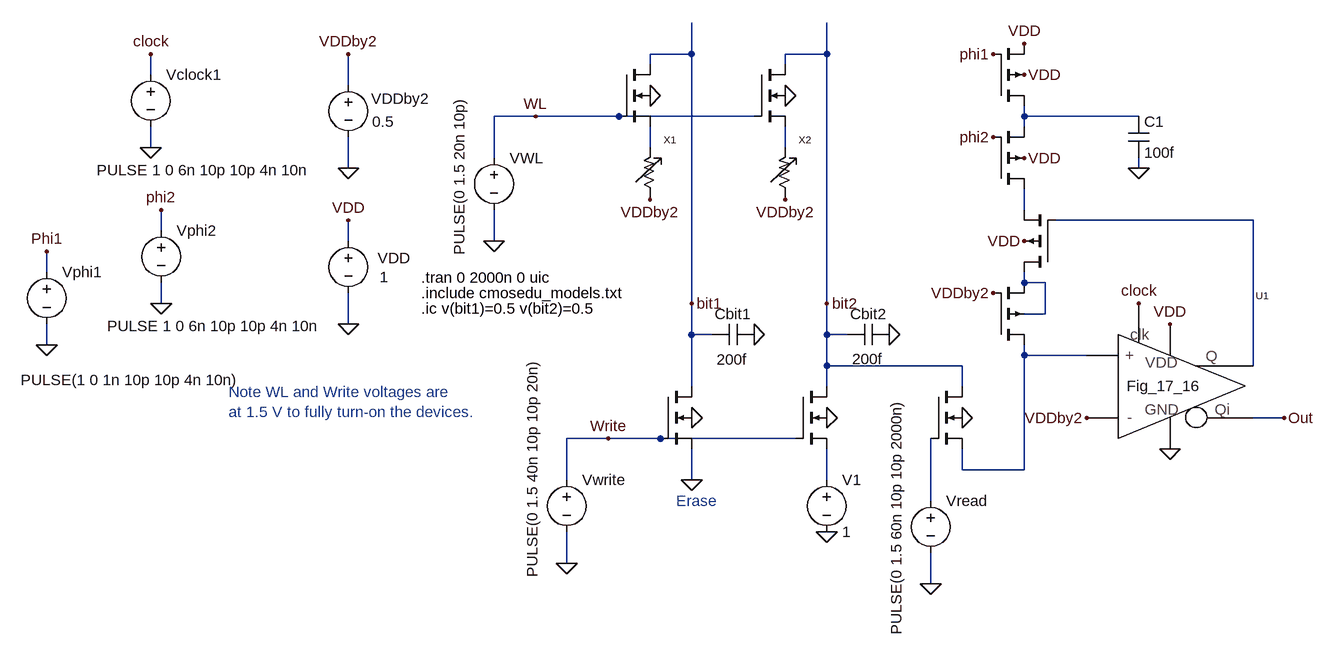
[diagram p0: schematic proj1_sim3.asc]
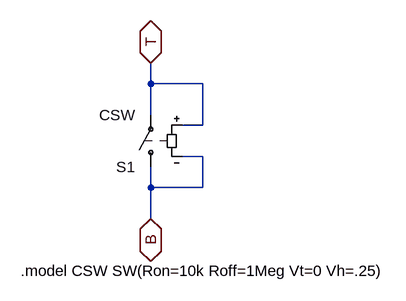
[diagram p1: sub-circuit mbit.asc]
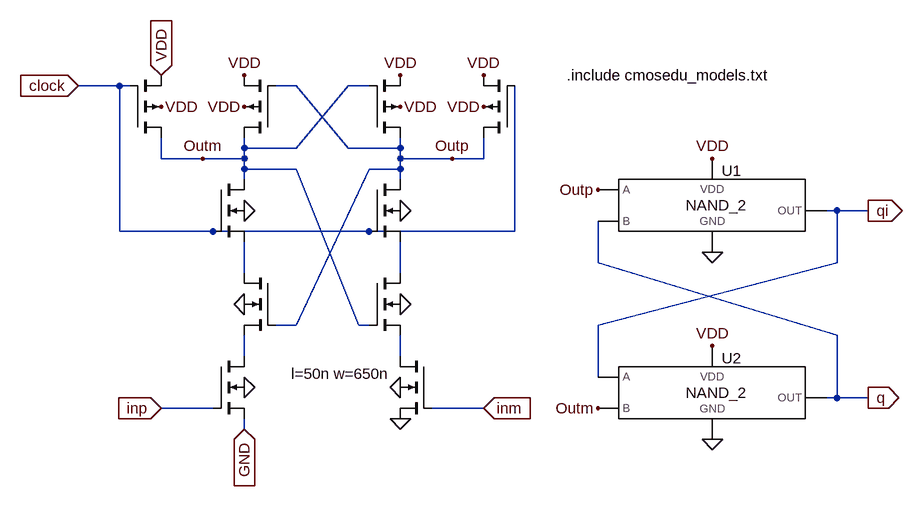
[diagram p2: sub-circuit fig_17_16.asc]
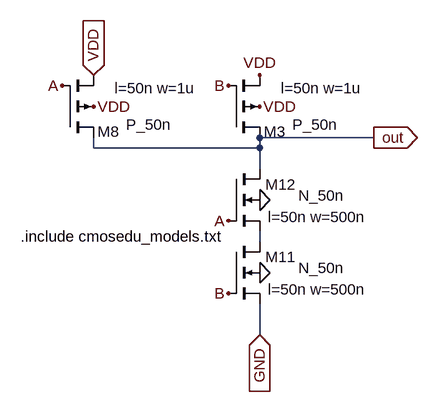
[diagram p3: sub-circuit nand_2.asc]
proj1_sim3.asc, the LTspice schematic file:
Version 4
SHEET 1 1612 1576
WIRE 368 -16 368 -64
WIRE 368 -16 304 -16
WIRE 576 -16 576 -64
WIRE 576 -16 512 -16
WIRE 304 0 304 -16
WIRE 512 0 512 -16
WIRE -464 16 -464 -16
WIRE -160 32 -160 -16
WIRE 128 80 64 80
WIRE 256 80 128 80
WIRE 464 80 256 80
WIRE 880 80 880 64
WIRE 1056 80 880 80
WIRE 880 96 880 80
WIRE -464 128 -464 96
WIRE 304 128 304 96
WIRE 512 128 512 96
WIRE 64 144 64 80
WIRE -160 160 -160 112
WIRE 1056 160 1056 144
WIRE 880 224 880 192
WIRE 1232 240 928 240
WIRE -448 256 -448 224
WIRE -160 272 -160 240
WIRE 64 272 64 224
WIRE -624 320 -624 288
WIRE 880 336 880 320
WIRE 912 336 880 336
WIRE -448 368 -448 336
WIRE 368 368 368 -16
WIRE 576 368 576 -16
WIRE 912 384 912 336
WIRE 912 384 880 384
WIRE -160 400 -160 352
WIRE 368 416 368 368
WIRE 400 416 368 416
WIRE 576 416 576 368
WIRE 608 416 576 416
WIRE -624 432 -624 400
WIRE 880 448 880 432
WIRE 976 448 880 448
WIRE 576 464 576 416
WIRE 784 464 576 464
WIRE 1232 464 1232 240
WIRE 368 496 368 416
WIRE 576 496 576 464
WIRE 784 496 784 464
WIRE 1280 544 1232 544
WIRE 240 576 176 576
WIRE 320 576 240 576
WIRE 528 576 320 576
WIRE 784 624 784 592
WIRE 880 624 880 448
WIRE 880 624 784 624
WIRE 176 640 176 576
WIRE 368 640 368 592
WIRE 576 640 576 592
WIRE 736 672 736 576
WIRE 176 768 176 720
WIRE 736 800 736 752
FLAG 304 48 0
FLAG 304 208 VDDby2
FLAG 512 48 0
FLAG 512 208 VDDby2
FLAG 64 272 0
FLAG 128 80 WL
FLAG 464 416 0
FLAG 672 416 0
FLAG 368 544 0
FLAG 576 544 0
FLAG 176 768 0
FLAG 240 576 Write
FLAG 368 640 0
FLAG -160 400 0
FLAG 368 368 bit1
FLAG 576 368 bit2
FLAG -160 160 0
FLAG -160 -16 VDDby2
FLAG -160 240 VDD
FLAG 576 720 0
FLAG 880 16 VDD
FLAG 880 -32 VDD
FLAG -624 432 0
FLAG -624 288 Phi1
FLAG -448 368 0
FLAG -448 224 phi2
FLAG 880 144 VDD
FLAG 880 272 VDD
FLAG 832 -16 phi1
FLAG 832 112 phi2
FLAG 1056 160 0
FLAG 832 352 VDDby2
FLAG 1104 400 VDD
FLAG -464 128 0
FLAG -464 -16 clock
FLAG 976 544 VDDby2
FLAG 1056 368 clock
FLAG 1104 592 0
FLAG 1280 544 Out
FLAG 784 544 0
FLAG 736 800 0
SYMBOL nmos4 256 0 R0
WINDOW 0 56 32 Invisible 0
WINDOW 3 56 72 Invisible 0
SYMATTR InstName M1
SYMATTR Value N_50n
SYMATTR Value2 l=50n w=250n
SYMBOL nmos4 464 0 R0
WINDOW 0 56 32 Invisible 0
WINDOW 3 56 72 Invisible 0
SYMATTR InstName M2
SYMATTR Value N_50n
SYMATTR Value2 l=50n w=250n
SYMBOL voltage 64 128 R0
WINDOW 3 -53 166 VLeft 0
WINDOW 123 0 0 Left 0
WINDOW 39 0 0 Left 0
SYMATTR Value PULSE(0 1.5 20n 10p)
SYMATTR InstName VWL
SYMBOL cap 672 400 R90
WINDOW 0 0 32 VBottom 0
WINDOW 3 38 33 VTop 0
SYMATTR InstName Cbit2
SYMATTR Value 200f
SYMBOL cap 464 400 R90
WINDOW 0 0 32 VBottom 0
WINDOW 3 39 34 VTop 0
SYMATTR InstName Cbit1
SYMATTR Value 200f
SYMBOL nmos4 320 496 R0
WINDOW 0 56 32 Invisible 0
WINDOW 3 56 72 Invisible 0
SYMATTR InstName M3
SYMATTR Value N_50n
SYMATTR Value2 l=50n w=2500n
SYMBOL nmos4 528 496 R0
WINDOW 0 56 32 Invisible 0
WINDOW 3 56 72 Invisible 0
SYMATTR InstName M4
SYMATTR Value N_50n
SYMATTR Value2 l=50n w=2500n
SYMBOL voltage 176 624 R0
WINDOW 3 -53 166 VLeft 0
WINDOW 123 0 0 Left 0
WINDOW 39 0 0 Left 0
SYMATTR Value PULSE(0 1.5 40n 10p 10p 20n)
SYMATTR InstName Vwrite
SYMBOL voltage -160 256 R0
WINDOW 0 45 42 Left 0
WINDOW 3 48 71 Left 0
SYMATTR InstName VDD
SYMATTR Value 1
SYMBOL voltage -160 16 R0
WINDOW 0 35 37 Left 0
WINDOW 3 37 72 Left 0
SYMATTR InstName VDDby2
SYMATTR Value 0.5
SYMBOL voltage 576 624 R0
WINDOW 123 0 0 Left 0
WINDOW 39 0 0 Left 0
SYMATTR InstName V1
SYMATTR Value 1
SYMBOL mbit 304 128 R0
SYMATTR InstName X1
SYMBOL mbit 512 128 R0
SYMATTR InstName X2
SYMBOL pmos4 832 64 M180
WINDOW 0 56 32 Invisible 0
WINDOW 3 56 72 Invisible 0
SYMATTR InstName M7
SYMATTR Value P_50n
SYMATTR Value2 l=50n w=1u
SYMBOL voltage -624 304 R0
WINDOW 123 0 0 Left 0
WINDOW 39 0 0 Left 0
WINDOW 3 -40 182 Left 0
SYMATTR Value PULSE(1 0 1n 10p 10p 4n 10n)
SYMATTR InstName Vphi1
SYMBOL voltage -448 240 R0
WINDOW 123 0 0 Left 0
WINDOW 39 0 0 Left 0
WINDOW 3 -83 163 Left 0
SYMATTR Value PULSE 1 0 6n 10p 10p 4n 10n
SYMATTR InstName Vphi2
SYMBOL pmos4 832 192 M180
WINDOW 0 56 32 Invisible 0
WINDOW 3 56 72 Invisible 0
SYMATTR InstName M8
SYMATTR Value P_50n
SYMATTR Value2 l=50n w=1u
SYMBOL pmos4 928 320 R180
WINDOW 0 56 32 Invisible 0
WINDOW 3 56 72 Invisible 0
SYMATTR InstName M9
SYMATTR Value P_50n
SYMATTR Value2 l=50n w=1u
SYMBOL cap 1040 80 R0
SYMATTR InstName C1
SYMATTR Value 100f
SYMBOL pmos4 832 432 M180
WINDOW 0 56 32 Invisible 0
WINDOW 3 56 72 Invisible 0
SYMATTR InstName M10
SYMATTR Value P_50n
SYMATTR Value2 l=50n w=1u
SYMBOL Fig_17_16 1024 496 R0
SYMATTR InstName U1
SYMBOL voltage -464 0 R0
WINDOW 123 0 0 Left 0
WINDOW 39 0 0 Left 0
WINDOW 3 -83 163 Left 0
SYMATTR Value PULSE 1 0 6n 10p 10p 4n 10n
SYMATTR InstName Vclock1
SYMBOL nmos4 736 496 R0
WINDOW 0 56 32 Invisible 0
WINDOW 3 56 72 Invisible 0
SYMATTR InstName M5
SYMATTR Value N_50n
SYMATTR Value2 l=50n w=250n
SYMBOL voltage 736 656 R0
WINDOW 3 -53 223 VLeft 0
WINDOW 123 0 0 Left 0
WINDOW 39 0 0 Left 0
SYMATTR Value PULSE(0 1.5 60n 10p 10p 2000n)
SYMATTR InstName Vread
TEXT -48 352 Left 0 !.include cmosedu_models.txt
TEXT -48 328 Left 0 !.tran 0 2000n 0 uic
TEXT -48 376 Left 0 !.ic v(bit1)=0.5 v(bit2)=0.5
TEXT -344 504 Left 0 ;Note WL and Write voltages are \nat 1.5 V to fully turn-on the devices.
TEXT 344 672 Left 0 ;Erase

mbit.asc, the sub-circuit schematic file:
Version 4
SHEET 1 984 680
WIRE -288 -128 -288 -160
WIRE -208 -128 -288 -128
WIRE -288 -80 -288 -128
WIRE -208 -64 -208 -128
WIRE -208 -64 -240 -64
WIRE -208 -16 -240 -16
WIRE -288 32 -288 0
WIRE -208 32 -208 -16
WIRE -208 32 -288 32
WIRE -288 80 -288 32
FLAG -288 -160 T
IOPIN -288 -160 BiDir
FLAG -288 80 B
IOPIN -288 80 BiDir
SYMBOL sw -288 16 R180
SYMATTR InstName S1
SYMATTR Value CSW
TEXT -488 160 Left 0 !.model CSW SW(Ron=10k Roff=1Meg Vt=0 Vh=.25)

fig_17_16.asc, the sub-circuit schematic file:
Version 4
SHEET 1 1760 680
WIRE 528 -560 464 -560
WIRE 544 -560 528 -560
WIRE 800 -560 768 -560
WIRE 912 -560 880 -560
WIRE 720 -464 720 -480
WIRE 800 -464 880 -560
WIRE 800 -464 720 -464
WIRE 880 -464 800 -560
WIRE 960 -464 960 -480
WIRE 960 -464 880 -464
WIRE 592 -448 592 -480
WIRE 656 -448 592 -448
WIRE 720 -448 720 -464
WIRE 720 -448 656 -448
WIRE 960 -448 960 -464
WIRE 1040 -448 960 -448
WIRE 1088 -448 1088 -480
WIRE 1088 -448 1040 -448
WIRE 720 -432 720 -448
WIRE 800 -432 720 -432
WIRE 960 -432 960 -448
WIRE 960 -432 912 -432
WIRE 720 -416 720 -432
WIRE 960 -416 960 -432
WIRE 1632 -368 1616 -368
WIRE 1680 -368 1632 -368
WIRE 528 -336 528 -560
WIRE 672 -336 528 -336
WIRE 912 -336 672 -336
WIRE 1136 -336 1136 -560
WIRE 1136 -336 912 -336
WIRE 1264 -288 1264 -352
WIRE 1632 -288 1632 -368
WIRE 720 -272 720 -320
WIRE 960 -272 960 -320
WIRE 800 -192 912 -432
WIRE 800 -192 768 -192
WIRE 896 -192 800 -432
WIRE 912 -192 896 -192
WIRE 1264 -192 1632 -288
WIRE 1632 -176 1264 -288
WIRE 720 -144 720 -176
WIRE 960 -144 960 -176
WIRE 1264 -112 1264 -192
WIRE 1632 -80 1632 -176
WIRE 1632 -80 1616 -80
WIRE 1680 -80 1632 -80
WIRE 672 -64 592 -64
WIRE 1088 -64 1008 -64
WIRE 720 -32 720 -48
FLAG 720 -96 0
FLAG 720 -528 VDD
FLAG 960 -528 VDD
FLAG 720 -576 VDD
FLAG 960 -576 VDD
FLAG 960 -224 0
FLAG 720 -224 0
FLAG 592 -528 VDD
FLAG 1088 -528 VDD
FLAG 1088 -576 VDD
FLAG 720 -368 0
FLAG 960 -368 0
FLAG 960 -96 0
FLAG 960 -48 0
FLAG 1040 -448 Outp
FLAG 656 -448 Outm
FLAG 1440 -304 0
FLAG 1440 -16 0
FLAG 1440 -448 VDD
FLAG 1440 -160 VDD
FLAG 1264 -400 Outp
FLAG 1264 -64 Outm
FLAG 592 -64 inp
IOPIN 592 -64 In
FLAG 1088 -64 inm
IOPIN 1088 -64 In
FLAG 464 -560 clock
IOPIN 464 -560 In
FLAG 1680 -368 qi
IOPIN 1680 -368 Out
FLAG 1680 -80 q
IOPIN 1680 -80 Out
FLAG 592 -576 VDD
IOPIN 592 -576 In
FLAG 720 -32 GND
IOPIN 720 -32 In
SYMBOL nmos4 672 -144 R0
WINDOW 0 104 24 Invisible 0
WINDOW 3 179 41 Invisible 0
SYMATTR InstName M1
SYMATTR Value N_50n
SYMATTR Value2 l=50n w=500n
SYMBOL pmos4 768 -480 R180
WINDOW 0 56 32 Invisible 0
WINDOW 3 56 72 Invisible 0
SYMATTR InstName M2
SYMATTR Value P_50n
SYMATTR Value2 l=50n w=1u
SYMBOL pmos4 912 -480 M180
WINDOW 0 56 32 Invisible 0
WINDOW 3 56 72 Invisible 0
SYMATTR InstName M3
SYMATTR Value P_50n
SYMATTR Value2 l=50n w=1u
SYMBOL nmos4 912 -272 R0
WINDOW 0 104 24 Invisible 0
WINDOW 3 179 41 Invisible 0
SYMATTR InstName M5
SYMATTR Value N_50n
SYMATTR Value2 l=50n w=500n
SYMBOL nmos4 768 -272 M0
WINDOW 0 104 24 Invisible 0
WINDOW 3 179 41 Invisible 0
SYMATTR InstName M6
SYMATTR Value N_50n
SYMATTR Value2 l=50n w=500n
SYMBOL pmos4 544 -480 M180
WINDOW 0 56 32 Invisible 0
WINDOW 3 56 72 Invisible 0
SYMATTR InstName M4
SYMATTR Value P_50n
SYMATTR Value2 l=50n w=1u
SYMBOL pmos4 1136 -480 R180
WINDOW 0 56 32 Invisible 0
WINDOW 3 56 72 Invisible 0
SYMATTR InstName M7
SYMATTR Value P_50n
SYMATTR Value2 l=50n w=1u
SYMBOL nmos4 672 -416 R0
WINDOW 0 104 24 Invisible 0
WINDOW 3 179 41 Invisible 0
SYMATTR InstName M8
SYMATTR Value N_50n
SYMATTR Value2 l=50n w=500n
SYMBOL nmos4 912 -416 R0
WINDOW 0 104 24 Invisible 0
WINDOW 3 179 41 Invisible 0
SYMATTR InstName M9
SYMATTR Value N_50n
SYMATTR Value2 l=50n w=500n
SYMBOL nmos4 1008 -144 M0
WINDOW 0 104 24 Invisible 0
WINDOW 3 179 41 Invisible 0
WINDOW 123 64 27 Left 0
SYMATTR InstName M10
SYMATTR Value N_50n
SYMATTR Value2 l=50n w=650n
SYMBOL NAND_2 1216 -352 R0
SYMATTR InstName U1
SYMBOL NAND_2 1216 -64 R0
SYMATTR InstName U2
TEXT 1216 -576 Left 0 !.include cmosedu_models.txt

nand_2.asc, the sub-circuit schematic file:
Version 4
SHEET 1 6288 680
WIRE 1344 -416 1168 -416
WIRE 912 -400 912 -416
WIRE 1168 -400 1168 -416
WIRE 1168 -400 912 -400
WIRE 1168 -368 1168 -400
WIRE 1168 -256 1168 -272
WIRE 1168 -112 1168 -160
FLAG 1168 -464 VDD
FLAG 912 -464 VDD
FLAG 1168 -208 0
FLAG 1168 -320 0
FLAG 1168 -512 VDD
FLAG 912 -512 VDD
IOPIN 912 -512 In
FLAG 1168 -112 GND
IOPIN 1168 -112 In
FLAG 1344 -416 out
IOPIN 1344 -416 Out
FLAG 864 -496 A
FLAG 1120 -288 A
FLAG 1120 -496 B
FLAG 1120 -176 B
SYMBOL pmos4 1120 -416 M180
WINDOW 0 88 9 Right 0
WINDOW 3 168 20 Right 0
WINDOW 123 206 76 Right 0
SYMATTR InstName M3
SYMATTR Value P_50n
SYMATTR Value2 l=50n w=1u
SYMBOL pmos4 864 -416 M180
WINDOW 0 88 9 Right 0
WINDOW 3 168 20 Right 0
WINDOW 123 206 76 Right 0
SYMATTR InstName M8
SYMATTR Value P_50n
SYMATTR Value2 l=50n w=1u
SYMBOL nmos4 1120 -256 R0
WINDOW 0 104 24 Right 0
WINDOW 3 179 41 Right 0
WINDOW 123 213 74 Right 0
SYMATTR InstName M11
SYMATTR Value N_50n
SYMATTR Value2 l=50n w=500n
SYMBOL nmos4 1120 -368 R0
WINDOW 0 104 24 Right 0
WINDOW 3 179 41 Right 0
WINDOW 123 213 74 Right 0
SYMATTR InstName M12
SYMATTR Value N_50n
SYMATTR Value2 l=50n w=500n
TEXT 800 -264 Left 0 !.include cmosedu_models.txt

The netlist it stands for:
* proj1_sim3.asc
M1 bit1 WL N002 0 N_50n l=50n w=250n
M2 bit2 WL N003 0 N_50n l=50n w=250n
VWL WL 0 PULSE(0 1.5 20n 10p)
Cbit2 0 bit2 200f
Cbit1 0 bit1 200f
M3 bit1 Write 0 0 N_50n l=50n w=2500n
M4 bit2 Write N008 0 N_50n l=50n w=2500n
Vwrite Write 0 PULSE(0 1.5 40n 10p 10p 20n)
VDD VDD 0 1
VDDby2 VDDby2 0 0.5
V1 N008 0 1
XX1 N002 VDDby2 mbit
XX2 N003 VDDby2 mbit
M7 N001 Phi1 VDD VDD P_50n l=50n w=1u
Vphi1 Phi1 0 PULSE(1 0 1n 10p 10p 4n 10n)
Vphi2 phi2 0 PULSE 1 0 6n 10p 10p 4n 10n
M8 N004 phi2 N001 VDD P_50n l=50n w=1u
M9 N006 N005 N004 VDD P_50n l=50n w=1u
C1 N001 0 100f
M10 N007 VDDby2 N006 N006 P_50n l=50n w=1u
XU1 N007 VDDby2 N005 Out clock VDD 0 fig_17_16 params: Fig_17_16
Vclock1 clock 0 PULSE 1 0 6n 10p 10p 4n 10n
M5 bit2 N009 N007 0 N_50n l=50n w=250n
Vread N009 0 PULSE(0 1.5 60n 10p 10p 2000n)

* block symbol definitions
.subckt mbit T B
S1 B T T B CSW
.model CSW SW(Ron=10k Roff=1Meg Vt=0 Vh=.25)
.ends mbit

.subckt fig_17_16 inp inm q qi clock VDD GND
M1 N003 inp GND 0 N_50n l=50n w=500n
M2 Outm Outp VDD VDD P_50n l=50n w=1u
M3 Outp Outm VDD VDD P_50n l=50n w=1u
M5 N002 Outm N004 0 N_50n l=50n w=500n
M6 N001 Outp N003 0 N_50n l=50n w=500n
M4 Outm clock VDD VDD P_50n l=50n w=1u
M7 Outp clock VDD VDD P_50n l=50n w=1u
M8 Outm clock N001 0 N_50n l=50n w=500n
M9 Outp clock N002 0 N_50n l=50n w=500n
M10 N004 inm 0 0 N_50n l=50n w=650n
XU1 Outp q qi VDD 0 nand_2 params: NAND_2
XU2 qi Outm q VDD 0 nand_2 params: NAND_2
.include cmosedu_models.txt
.ends fig_17_16

.subckt nand_2 A B OUT VDD GND
M3 out B VDD VDD P_50n l=50n w=1u
M8 out A VDD VDD P_50n l=50n w=1u
M11 N001 B GND 0 N_50n l=50n w=500n
M12 out A N001 0 N_50n l=50n w=500n
.include cmosedu_models.txt
.ends nand_2

.model NMOS NMOS
.model PMOS PMOS
.lib standard.mos
.include cmosedu_models.txt
.tran 0 2000n 0 uic
.ic v(bit1)=0.5 v(bit2)=0.5
* Note WL and Write voltages are
* at 1.5 V to fully turn-on the devices.
* Erase
.backanno
.end